# EAGLE design Adafruit USB Isolator (EAGLE 6.3)
COMPANY: ADAFRUIT INDUSTRIES; DRAWN: KTOWN; REV: B
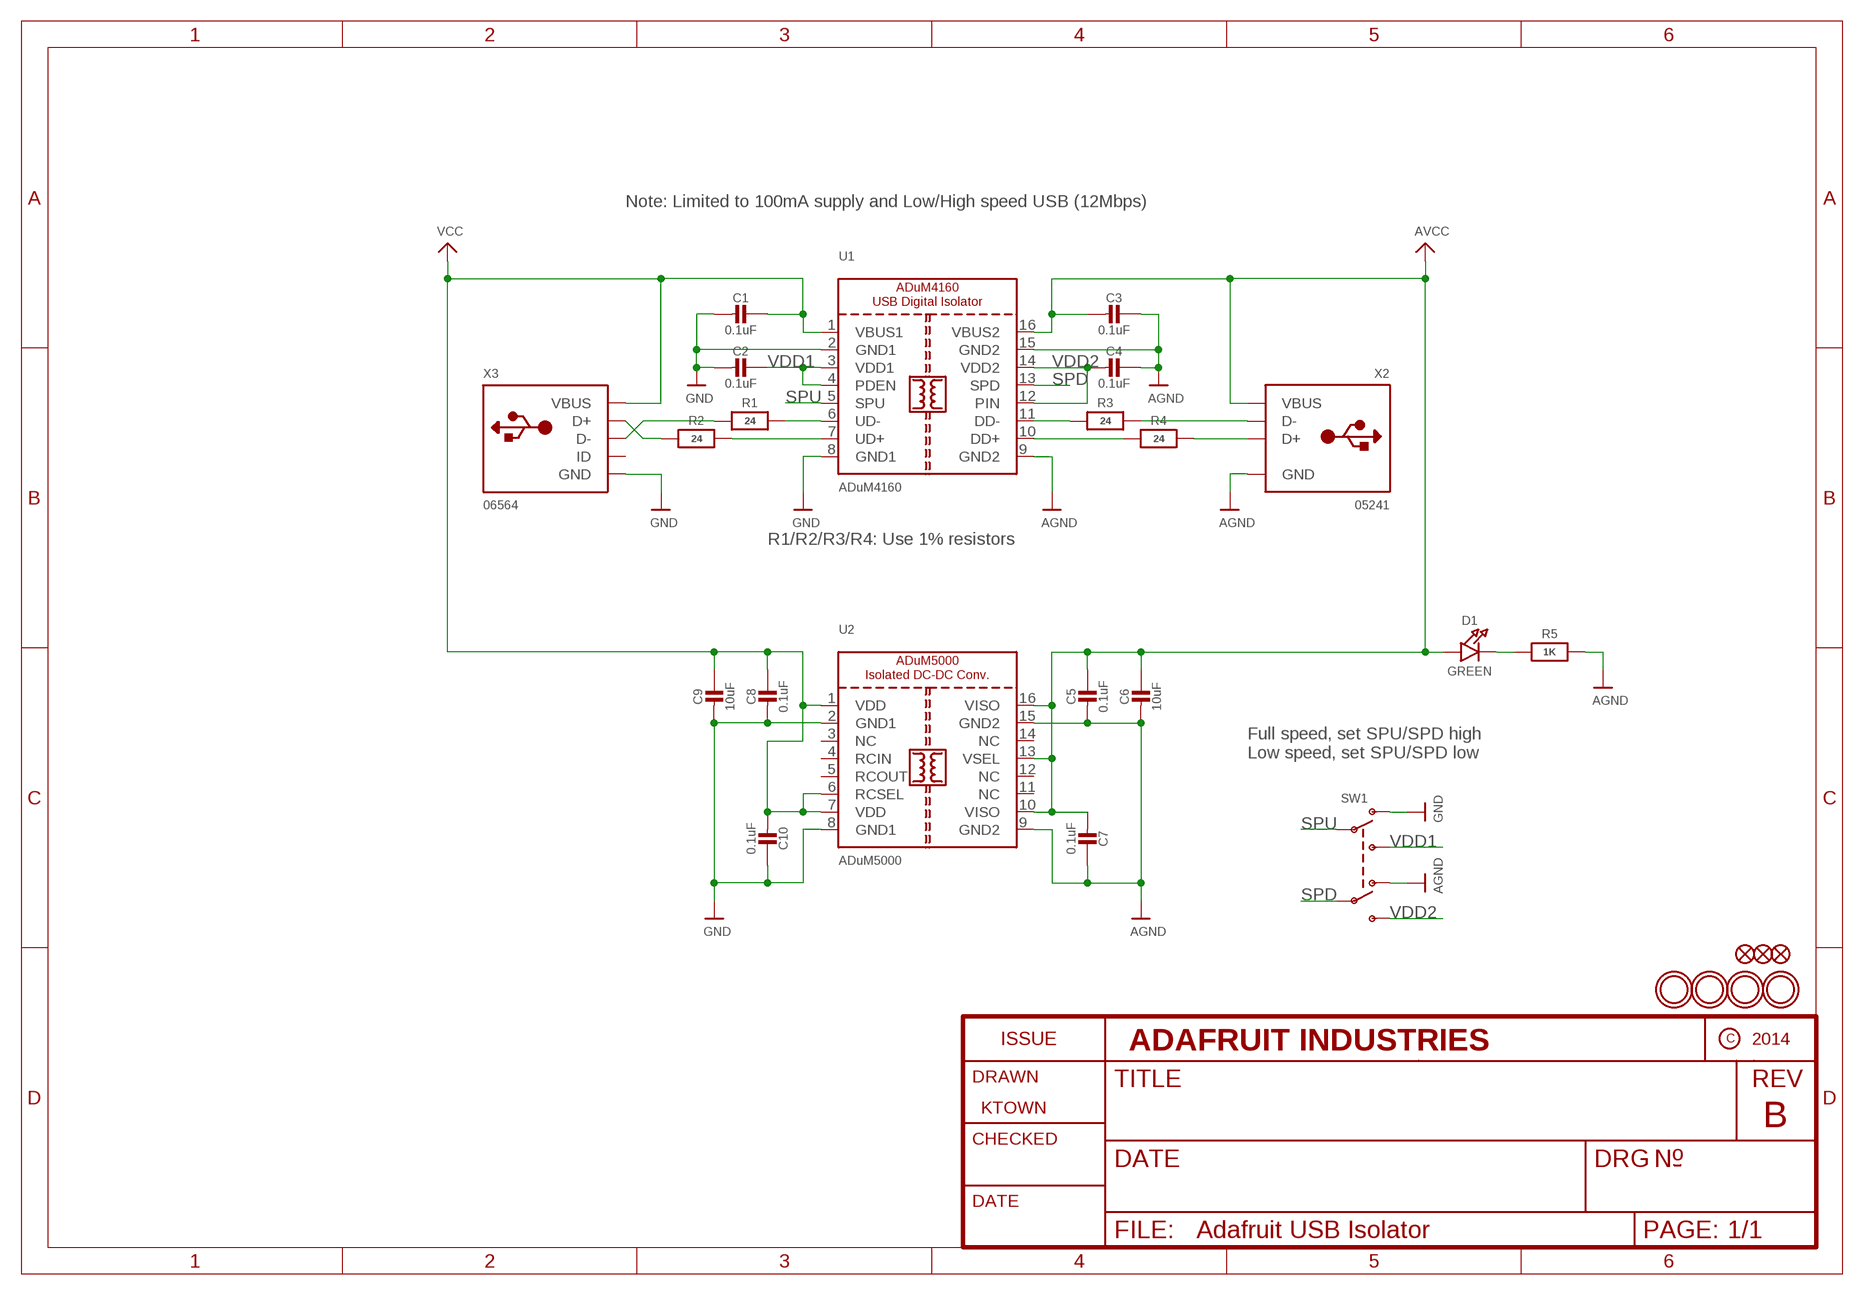
[diagram p0: schematic, sheet 1]

## Parts
C1  0.1uF  CAP_CERAMIC0805-NOOUTLINE  [0805-NO]
C2  0.1uF  CAP_CERAMIC0805-NOOUTLINE  [0805-NO]
C3  0.1uF  CAP_CERAMIC0805-NOOUTLINE  [0805-NO]
C4  0.1uF  CAP_CERAMIC0805-NOOUTLINE  [0805-NO]
C5  0.1uF  CAP_CERAMIC0805-NOOUTLINE  [0805-NO]
C6  10uF  CAP_CERAMIC0805-NOOUTLINE  [0805-NO]
C7  0.1uF  CAP_CERAMIC0805-NOOUTLINE  [0805-NO]
C8  0.1uF  CAP_CERAMIC0805-NOOUTLINE  [0805-NO]
C9  10uF  CAP_CERAMIC0805-NOOUTLINE  [0805-NO]
C10  0.1uF  CAP_CERAMIC0805-NOOUTLINE  [0805-NO]
D1  GREEN  LED0805_NOOUTLINE  [CHIPLED_0805_NOOUTLINE]
FID1  FIDUCIAL""  [FIDUCIAL_1MM]
FID2  FIDUCIAL""  [FIDUCIAL_1MM]
FID3  FIDUCIAL""  [FIDUCIAL_1MM]
R1  24  RESISTOR0805_NOOUTLINE  [0805-NO]
R2  24  RESISTOR0805_NOOUTLINE  [0805-NO]
R3  24  RESISTOR0805_NOOUTLINE  [0805-NO]
R4  24  RESISTOR_0805MP  [_0805MP]
R5  1K  RESISTOR0805_NOOUTLINE  [0805-NO]
SW1  SWITCH_DPDTEG1390  [EG1390]
U1  ADuM4160  ADUM4160  [SOIC16WIDE]
U2  ADuM5000  ADUM5000  [SOIC16WIDE]
U$7  MOUNTINGHOLE2.5_THICK  [MOUNTINGHOLE_2.5_PLATED_THICK]
U$8  MOUNTINGHOLE2.5_THICK  [MOUNTINGHOLE_2.5_PLATED_THICK]
U$9  MOUNTINGHOLE2.5_THICK  [MOUNTINGHOLE_2.5_PLATED_THICK]
U$10  MOUNTINGHOLE2.5_THICK  [MOUNTINGHOLE_2.5_PLATED_THICK]
X2  05241  USB_TYPEAPTHFML  [USB_HOST-PTH]
X3  06564  USBMINIBLARGE  [USB-MINIB_LARGER]

## Nets
AGND: C3.1 C4.1 C5.2 C6.2 C7.1 R5.2 SW1.O2 U1.9(GND2) U1.15(GND2) U2.9(GND2) U2.15(GND2) X2.GND
AVCC: C3.2 C5.1 C6.1 C7.2 D1.A U1.16(VBUS2) U2.10(VISO) U2.13(VSEL) U2.16(VISO) X2.VBUS
GND: C1.2 C2.2 C8.2 C9.2 C10.1 SW1.O1 U1.2(GND1) U1.8(GND1) U2.2(GND1) U2.8(GND1) X3.GND X3.GND1(GND) X3.GND2(GND) X3.GND3(GND) X3.GND4(GND)
N$1: R2.1 X3.D+
N$2: R2.2 U1.7(UD+)
N$3: R1.2 U1.6(UD-)
N$4: R1.1 X3.D-
N$5: R4.1 U1.10(DD+)
N$6: R4.2 X2.D+
N$7: R3.2 X2.D-
N$8: R3.1 U1.11(DD-)
N$9: D1.C R5.1
SPD: SW1.P2 U1.13(SPD)
SPU: SW1.P1 U1.5(SPU)
VCC: C1.1 C8.1 C9.1 C10.2 U1.1(VBUS1) U2.1(VDD) U2.6(RCSEL) U2.7(VDD) X3.VBUS
VDD1: C2.1 SW1.S1 U1.3(VDD1) U1.4(PDEN)
VDD2: C4.2 SW1.S2 U1.12(PIN) U1.14(VDD2)
Unconnected: U2.3(NC) U2.4(RCIN) U2.5(RCOUT) U2.11(NC) U2.12(NC) U2.14(NC) X3.ID

## Notes on the sheet
- Note: Limited to 100mA supply and Low/High speed USB (12Mbps)
- R1/R2/R3/R4: Use 1% resistors
- Full speed, set SPU/SPD high
  Low speed, set SPU/SPD low

## Library data of the parts
C1-C10 = microbuilder:CAP_CERAMIC: Ceramic Capacitors For new designs, use the packages preceded by an '_' character since they are more reliable: The following footprints should be used on most boards: _0402 - Standard footprint for regular board layouts _0603 - Standard footprint for regular board layouts _0805 - Standard footprint for regular board layouts _1206 - Standard footprint for regular board layouts For extremely tight-pitch boards where space is at a premium, the following 'micro-pitch' footprints can be used (smaller pads, no silkscreen outline, etc.): _0402MP - Micro-pitch footprint for very dense/compact boards _0603MP - Micro-pitch footprint for very dense/compact boards _0805MP - Micro-pitch footprint for very dense/compact boards _1206MP - Micro-pitch footprint for very dense/compact boards
D1 = microbuilder:LED: LED 0603 - 0603 Surface Mount Package 2mA: Green LED - Low Power (3.9mcd, 2ma, 1.7Vf) - Digikey: 475-2709-2-ND Orange LED - Low Power (9.8mcd, 2ma, 1.8Vf) - Digikey: 475-1194-2-ND Red LED - Low Power (5mcd, 2ma, 1.8Vf) - Digikey: 475-1195-2-ND Yellow LED - Low Power (7mcd, 2ma, 1.8Vf) - Digikey: 475-1196-2-ND 5mA: Blue LED - Low Power (17mcd, 5ma, 2.9Vf) - Digikey: LNJ937W8CRACT-ND 0805 - 0805 Surface Mount Package 2mA: Red LED (8.8mcd, 2mA, 1.8Vf, Clear) - Low Power [Digikey: 475-2510-1-ND] Green LED (5mcd, 2mA, 1.8Vf, Clear) - Low Power [Digikey: 475-2730-1-ND] Yellow LED (11.3mcd, 2mA, 1.8Vf, Clear) - Low Power [Digikey: 475-2555-1-ND] 20mA: Red LED (104mcd, 20mA, Diffused) - LS R976 [Digikey: 475-1278-6-ND] Red LED (12mcd, 20mA, 2.0Vf, Clear) - APT2012EC [Digikey: 754-1128-1-ND] Green LED (15mcd, 20mA, 2.2Vf, Clear) - APT2012GC [Digikey: 754-1131-1-ND] Orange LED (160mcd, 20mA, 2.1Vf, Clear) - APT2012SECK [Digikey: 754-1130-1-ND] 1206 - 1206 Surface Mount Package Green LED (26mcd, 20mA, Diffused) - LG N971 [Digikey: 475-1407-6-ND] Red LED (15mcd, 20mA, Diffused) - LH N974 [Digikey: 475-1416-6-ND] Cree - Cree High-Power Surface Mount LEDs XPEBWT-L1-0000-00D50 - White 111lm 350mA 2.9Vf 6200K 110° XTEAWT-00-0000-00000LEE3 - White 114lm 350mA 2.85Vf 5000K 115° Everlight - Everlight 45-21 Series Surface Mount LEDs 45-21/QK2C-B2832AC2CB2/2T - Warm White 2000mcd 20mA 3.25Vf 3050K 120° 45-21/LK2C-B38452C4CB2/2T - Nuetral White 2000mcd 20mA 3.25Vf 4150K 120° 45-21/LK2C-B50634C6CB2/2T - Cold White 2200mcd 20mA 3.25Vf 5650K 120° PLCC2 Reverse Mount LS T77K-J1L2-1-0-2-R18-Z - Red 11.25mcd 2mA 1.8Vf 630nm 120° LO T77K-L1M2-24-Z - Orange 19.6mcd 2mA 1.8Vf 606nm 120° LY T77K-K2M1-26-Z - Yellow 15.7mcd 2mA 1.8Vf 587nm 120°
FID1-FID3 = microbuilder:FIDUCIAL: Fiducial Alignment Points Various fiducial points for machine vision alignment.; BOM: EXCLUDE
R1-R5 = microbuilder:RESISTOR: Resistors For new designs, use the packages preceded by an '_' character since they are more reliable: The following footprints should be used on most boards: _0402 - Standard footprint for regular board layouts _0603 - Standard footprint for regular board layouts _0805 - Standard footprint for regular board layouts _1206 - Standard footprint for regular board layouts For extremely tight-pitch boards where space is at a premium, the following 'micro-pitch' footprints can be used (smaller pads, no silkscreen outline, etc.): _0402MP - Micro-pitch footprint for very dense/compact boards _0603MP - Micro-pitch footprint for very dense/compact boards _0805MP - Micro-pitch footprint for very dense/compact boards _1206MP - Micro-pitch footprint for very dense/compact boards
SW1 = microbuilder:SWITCH_DPDT: Switch - DPDT A DPDT Switch acts like an SPDT switch, but has a pair of switches instead of just one. Vertical - 0.3A @ 6V SMT - Digikey: JS202011SCQN
U1 = microbuilder:ADUM4160: ADuM4160 Digital USB Isolator
U2 = microbuilder:ADUM5000: ADuM5000 Isolate DC-to-DC Converter 100mA output Regulated 5.0V or 3.3V output Output Voltage Selection: When VSEL = VISO, output = 5.0V, when VSEL = GND2, output = 3.3V
U$7-U$10 = microbuilder:MOUNTINGHOLE: Mounting Hole For #2 screws (0.086"/2.18mm width, 0.094"/2.4mm hole) use 2.5mm; BOM: EXCLUDE
X2 = microbuilder:USB_TYPEA: USB - Type A Connectors Male types stick out and are inserted into a PC or matching females parts (these are the connectors used on USB Memory Sticks, etc.). Female parts are generally used for USB Host and accept a male-type connector. SMT - 4UCON: 10017 PTHFML - Digikey: 609-1045-ND, 4UCon: 05241 PCB - Use 2.0mm thick PCBs with this footprint
X3 = microbuilder:USB: USB Connectors USBMINIB - Surface Mount Female Mini-B USB Connector 4UConnector: 06564

## Board
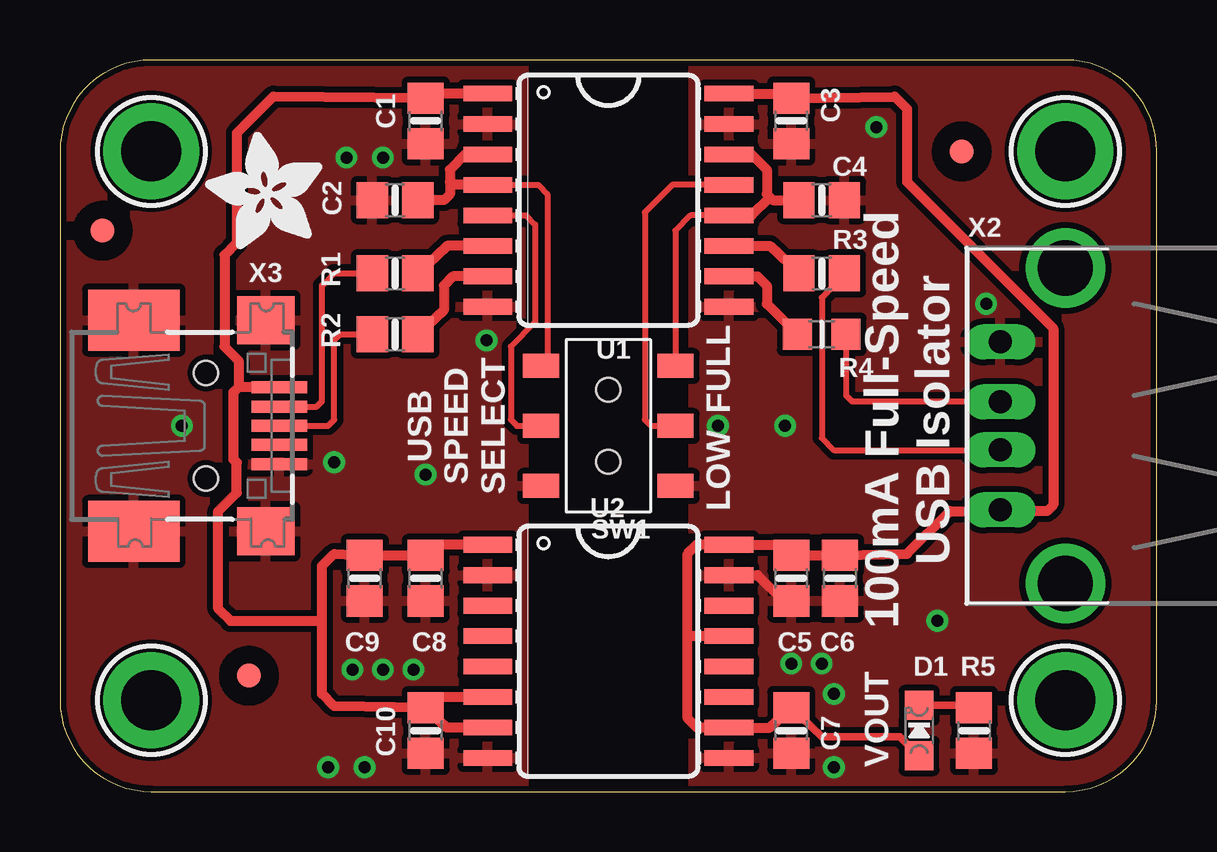
[diagram p1: board, top side]
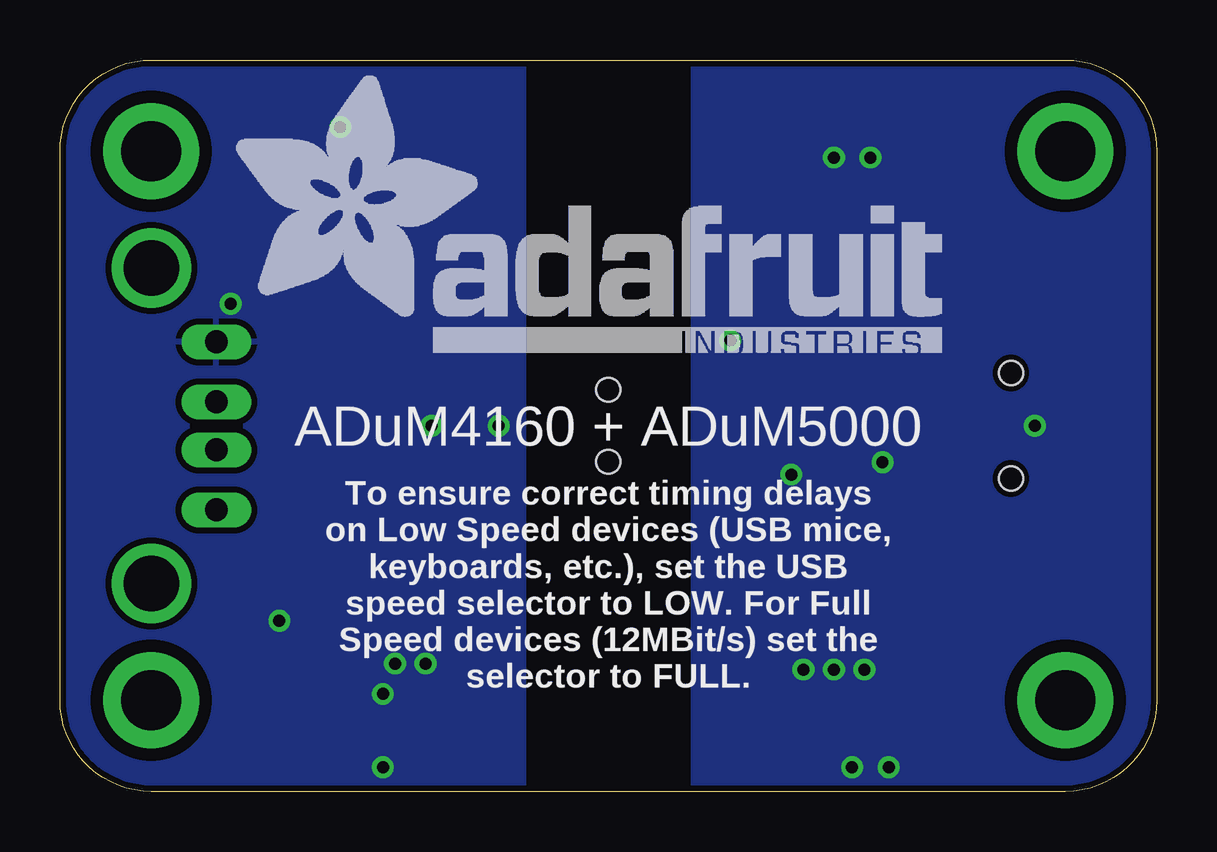
[diagram p2: board, bottom side, seen from below]

Size 45.72 x 30.48 mm. Coordinates in mm from the lower left corner, seen from the top.
Outline: 0,3.81 arc90 3.81,0 41.91,0 arc90 45.72,3.81 45.72,26.67 arc90 41.91,30.48 3.81,30.48 arc90 0,26.67 0,3.81
Copper layers (1*16): Top 0.035mm / dielectric 1.5mm / Bottom 0.035mm
Design rules "adafruit": minimum track width 8mil, minimum drill 15.5mil, track to track 8mil, track to pad 8mil, pad to pad 8mil, via to via 8mil, smd to smd 8mil, copper to edge 10mil, drill to drill 8mil, minimum pad ring 10mil, minimum via ring 8mil, stop-mask expansion 2mil, vias tented up to drill 20mil, thermal gap 10mil

### Footprints (pad centres in the part's own frame; a part is rotated, then mirrored left to right if it is on the bottom)
0805-NO = smd 1.3 x 1.5: 1 -0.95,0; 2 0.95,0
CHIPLED_0805_NOOUTLINE = smd 1.2 x 1.2: A 0,-1.05; C 0,1.05
FIDUCIAL_1MM = smd 1 x 1: 1 0,0
_0805MP = smd 1.2 x 1.3: 1 -1.016,0; 2 1.016,0
EG1390 = smd 1 x 1.5: O1 -2.5,2.8; O2 -2.5,-2.8; P1 0,2.8; P2 0,-2.8; S1 2.5,2.8; S2 2.5,-2.8 | hole 1: 1.5,0; -1.5,0
SOIC16WIDE = smd 0.66 x 2.032: 1 -4.445,-5.029; 2 -3.175,-5.029; 3 -1.905,-5.029; 4 -0.635,-5.029; 5 0.635,-5.029; 6 1.905,-5.029; 7 3.175,-5.029; 8 4.445,-5.029; 9 4.445,5.029; 10 3.175,5.029; 11 1.905,5.029; 12 0.635,5.029; 13 -0.635,5.029; 14 -1.905,5.029; 15 -3.175,5.029; 16 -4.445,5.029
MOUNTINGHOLE_2.5_PLATED_THICK = drill 2.5 pad 4: P$1 0,0
USB_HOST-PTH = drill 0.95 long: D+ 1,6.52; D- -1,6.52; GND 3.5,6.52; VBUS -3.5,6.52 | drill 2.3 pad 2.9: S1 -6.57,3.81; S2 6.57,3.81
USB-MINIB_LARGER = smd 0.5 x 2.308: D+ 0,4.064; D- -0.8,4.064; GND 1.6,4.064; ID 0.8,4.064; VBUS -1.6,4.064 | smd 2.54 x 3.81: GND1 -4.4,-2; GND4 4.4,-2 | smd 2 x 2.4: GND2 -4.4,3.5; GND3 4.4,3.5 | hole 1: -2.2,1; 2.2,1

### Placement (x,y rotation side)
C1  15.24,27.94 270 top
C2  13.97,24.64 180 top
C3  30.48,27.94 90 top
C4  31.75,24.64 180 top
C5  30.48,8.89 270 top
C6  32.51,8.89 270 top
C7  30.48,2.54 90 top
C8  15.24,8.89 270 top
C9  12.7,8.89 270 top
C10  15.24,2.54 90 top
D1  35.81,2.54 0 top
FID1  7.87,4.83 0 top
FID2  37.59,26.67 0 top
FID3  1.78,23.37 0 top
R1  13.97,21.59 0 top
R2  13.97,19.05 0 top
R3  31.75,21.59 0 top
R4  31.75,19.05 0 top
R5  38.1,2.54 270 top
SW1  22.86,15.24 90 top
U1  22.86,24.64 270 top
U2  22.86,5.84 270 top
U$7  41.91,26.67 0 top
U$8  3.81,3.81 0 top
U$9  3.81,26.67 0 top
U$10  41.91,3.81 0 top
U$14  [ADAFRUIT_5MM]  10.92,22.61 90 top
U$16  [ADAFRUIT_TEXT_30MM]  38.61,18.29 0 bottom
X2  45.72,15.24 90 top
X3  5.08,15.24 270 top

### Tracks (layer width: path | path; a pad name or v marks a point on that pad's centre or on a via)
AGND  (via drill 0.5)
  Top 0.406: U2.15 29.08,9.02 30.16,7.94 C5.2
  other vias: 34.04,27.69 38.61,20.32 27.43,15.24 36.58,7.11 30.48,5.33 31.75,5.33 30.23,15.24 32.26,1.02 32.26,4.06
  pour Top (isolate 0.254): 26.4,0 26.4,30.48 45.72,30.48 45.72,0
  pour Bottom (isolate 0.254): 26.4,0 26.4,30.48 45.72,30.48 45.72,0
AVCC
  Top 0.305: C7.2 31.75,2.29 35.02,2.29 D1.A
  Top 0.406: 26.16,6.6 26.16,3.05 26.54,2.67 U2.10 29.59,2.67 C7.2 | 26.16,6.6 26.16,9.91 26.54,10.29 U2.16 30.1,10.29 C5.1 C6.1 35.31,9.91 37.08,11.68 39.14,11.68 X2.VBUS 39.26,11.68 41.15,11.68 41.4,11.94 41.4,19.3 35.31,25.4 35.31,28.45 34.8,28.96 C3.2 30.35,29.08 U1.16 | U2.13 26.29,6.48 26.16,6.6
GND  (via drill 0.5)
  Top 0.406: U1.8 17.14,20.19
  other vias: 5.08,15.24 11.43,13.72 13.46,26.42 12.19,5.08 11.94,26.42 13.46,5.08 14.73,5.08 15.24,13.21 17.78,18.8 12.7,1.02 11.18,1.02
  pour Top (isolate 0.254): 0,0 0,30.48 19.32,30.48 19.32,0
  pour Bottom (isolate 0.254): 0,0 0,30.48 19.32,30.48 19.32,0
N$1
  Top 0.254: R2.1 11.68,19.05 11.43,18.8 11.43,15.49 11.18,15.24 X3.D+
N$2
  Top 0.406: U1.7 16.38,21.46 16,21.08 16,20.07 R2.2
N$3
  Top 0.406: U1.6 16.13,22.73 R1.2
N$4
  Top 0.254: X3.D- 10.71,16.04 10.92,16.26 10.92,21.08 11.43,21.59 R1.1
N$5
  Top 0.406: U1.10 29.08,21.46 29.46,21.08 29.46,20.32 R4.1
N$6
  Top 0.254: R4.2 32.77,16.51 33.02,16.26 39.18,16.26 X2.D+
N$7
  Top 0.254: R3.2 32,20.83 31.75,20.57 31.75,14.73 32.26,14.22 39.18,14.22 X2.D-
N$8
  Top 0.406: U1.11 29.59,22.73 R3.1
N$9
  Top 0.305: D1.C 38.07,3.59 R5.1
SPD
  Top 0.254: U1.13 25.53,25.27 24.38,24.13 24.38,15.49 24.64,15.24 SW1.P2
SPU
  Top 0.254: U1.5 19.43,24 19.81,23.62 19.81,19.56 18.8,18.54 18.8,15.49 19.05,15.24 SW1.P1
VCC
  Top 0.406: X3.VBUS 7.44,16.84 | 7.44,16.84 7.24,16.64 7.24,13.84 7.37,13.72 7.37,12.45 6.6,11.68 6.6,7.62 7.11,7.11 10.92,7.11 | C10.2 11.43,3.56 10.92,4.06 10.92,7.11 | 10.92,7.11 10.92,9.4 11.43,9.91 C9.1 C8.1 15.62,10.29 U2.1 | U2.6 15.62,3.94 C10.2 | U2.7 16.13,2.67 C10.2 | U1.1 15.37,29.08 C1.1 8.89,28.96 7.37,27.43 7.37,22.86 6.86,22.35 6.86,18.54 7.44,17.96 7.44,16.84
VDD1
  Top 0.254: U1.4 19.94,25.27 20.32,24.89 20.32,18 SW1.S1
  Top 0.406: U1.3 16.89,26.54 16.26,25.91 16.26,25.4 | 16.26,25.4 16.26,24.89 16,24.64 C2.1 | U1.4 16.38,25.27 16.26,25.4
VDD2
  Top 0.254: 30.35,24.77 C4.2 | U1.12 26.29,24 25.65,23.37 SW1.S2
  Top 0.406: U1.14 28.83,26.54 29.46,25.91 29.46,24.89 29.59,24.77 | 29.59,24.77 29.72,24.64 C4.2 | U1.12 28.83,24 29.59,24.77

### Text on the board
tPlace: FULL | USB / SPEED / SELECT | 100mA Full-Speed / USB Isolator | LOW | VOUT
bPlace: ADuM4160 + ADuM5000 | To ensure correct timing delays / on Low Speed devices (USB mice, / keyboards, etc.), set the USB / speed selector to LOW. For Full / Speed devices (12MBit/s) set the / selector to FULL.